# Altium schematic sheet inout.SchDoc
size A4
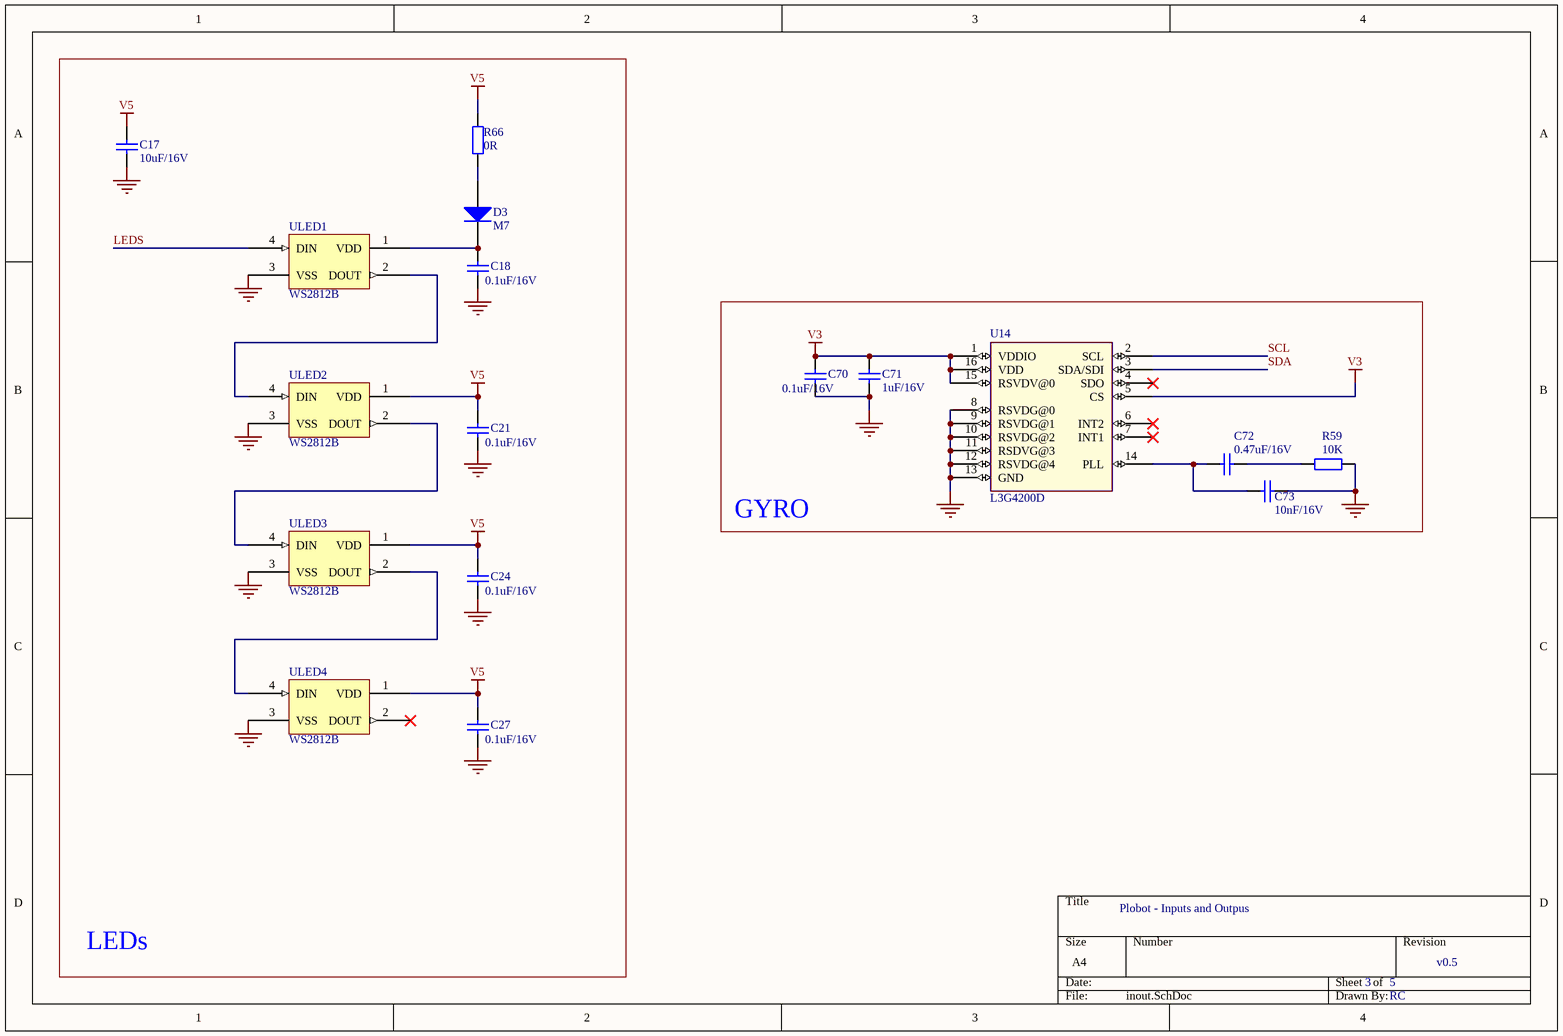
[diagram p0: inout.SchDoc]

## Parts
C17  10uF/16V  [CAPC1608N]
C18  0.1uF/16V  [CAPC1608N]
C21  0.1uF/16V  [CAPC1608N]
C24  0.1uF/16V  [CAPC1608N]
C27  0.1uF/16V  [CAPC1608N]
C70  0.1uF/16V  [CAPC1608N]
C71  1uF/16V  [CAPC1608N]
C72  0.47uF/16V  [CAPC1608N]
C73  10nF/16V  [CAPC1608N]
D3  M7  [SMA]
R59  10K  [RESC1608N]
R66  0R  [RESC1608N]
U14  L3G4200D  [LGA16-4X4]
ULED1  WS2812B  [WS2812B]
ULED2  WS2812B  [WS2812B]
ULED3  WS2812B  [WS2812B]
ULED4  WS2812B  [WS2812B]

## Blocks framed on the sheet
LEDs: C17 C18 C21 C24 C27 D3 R66 ULED1-ULED4
GYRO: C70-C73 R59 U14

## Nets
GND: C17.2 C18.2 C21.2 C24.2 C27.2 C70.2 C71.2 C73.2 R59.2 U14.8(RSVDG@0) U14.9(RSVDG@1) U14.10(RSVDG@2) U14.11(RSDVG@3) U14.12(RSVDG@4) U14.13(GND) ULED1.3(VSS) ULED2.3(VSS) ULED3.3(VSS) ULED4.3(VSS)
V3: C70.1 C71.1 U14.1(VDDIO) U14.5(CS) U14.15(RSVDV@0) U14.16(VDD)
V5: C17.1 C21.1 C24.1 C27.1 R66.2 ULED2.1(VDD) ULED3.1(VDD) ULED4.1(VDD)
LEDS: ULED1.4(DIN)
SCL: U14.2(SCL)
SDA: U14.3(SDA/SDI)
NetC18_1: C18.1 D3.2(K) ULED1.1(VDD)
NetC72_1: C72.1 C73.1 U14.14(PLL)
NetC72_2: C72.2 R59.1
NetD3_1: D3.1(A) R66.1
NetULED1_2: ULED1.2(DOUT) ULED2.4(DIN)
NetULED2_2: ULED2.2(DOUT) ULED3.4(DIN)
NetULED3_2: ULED3.2(DOUT) ULED4.4(DIN)

Not connected (* = marked no-connect by the designer): U14 4(SDO)* 6(INT2)* 7(INT1)*; ULED4 2(DOUT)*

## Notes on the sheet
- Plobot - Inputs and Outpus
- 3
- 5
- v0.5
- RC

## Library data of the parts
C17 C71-C73 = Cap_2: Capacitor; PackageReference: RAD-0.3
  C17: Published: 8-Jun-2000; LatestRevisionDate: 17-Jul-2002; LatestRevisionNote: Re-released for DXP Platform.; Publisher: Altium Limited; PackageDescription: Radial Cap, Thru-Hole; 2 Leads; 0.3 in Pin Spacing; Value: 10uF/16V
  C71: Value: 1uF/16V; ComponentLink3Description: DIGIKEY
  C72: Value: 0.47uF/16V; ComponentLink3Description: DIGIKEY
  C73: Value: 10nF/16V; ComponentLink3Description: DIGIKEY
C18 C21 C24 C27 C70 = Cap: Capacitor; PackageReference: RAD-0.3; Value: 0.1uF/16V
  C18 C21 C24 C27: Published: 8-Jun-2000; LatestRevisionDate: 17-Jul-2002; LatestRevisionNote: Re-released for DXP Platform.; Publisher: Altium Limited; PackageDescription: Radial Cap, Thru-Hole; 2 Leads; 0.3 in Pin Spacing
  C70: ComponentLink3Description: DIGIKEY
D3 = Diode: Default Diode; Published: 8-Jun-2000; LatestRevisionDate: 17-Jul-2002; LatestRevisionNote: Re-released for DXP Platform.; PackageVersion: Sep-1996; PackageReference: SMC; Publisher: Altium Limited; PackageDescription: DO-214-AB/SMC; 2 C-Bend Leads; Body 7.9 x 5.9 mm, inc. leads (LxW); Code_JEDEC: DO-214-AB
R59 R66 = Res2: Resistor; PackageReference: AXIAL-0.4
  R59: Value: 10K; ComponentLink3Description: DIGIKEY
  R66: Published: 8-Jun-2000; LatestRevisionDate: 17-Jul-2002; LatestRevisionNote: Re-released for DXP Platform.; Publisher: Altium Limited; Value: 0R
U14 = L3G4200D: L3G4200D Series 2.4 - 3.6 V Three-axis Angular Rate MEMS Motion Sensor - LGA-16; Price: 1.5 USD; Value: *; ComponentLink3Description: DIGIKEY; ComponentLink3URL: http://www.digikey.com/product-detail/en/stmicroelectronics/L3G4200DTR/497-11071-6-ND/2587913